# EAGLE design untitled (EAGLE 7.2.0)
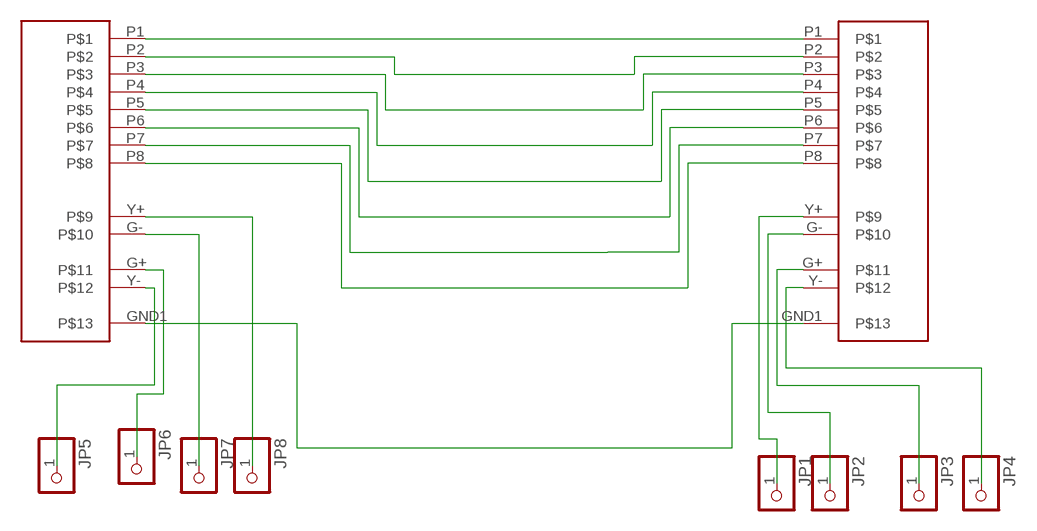
[diagram p0: schematic, sheet 1]

## Parts
JP1  PINHD-1X1  [1X01]
JP2  PINHD-1X1  [1X01]
JP3  PINHD-1X1  [1X01]
JP4  PINHD-1X1  [1X01]
JP5  PINHD-1X1  [1X01]
JP6  PINHD-1X1  [1X01]
JP7  PINHD-1X1  [1X01]
JP8  PINHD-1X1  [1X01]
U$14  RJ-45_LEDS  [RJ-45_LEDS]
U$15  RJ-45_LEDS  [RJ-45_LEDS]

## Nets
N$1: U$14.P1 U$15.P1
N$2: U$14.GND1 U$15.GND1
N$3: JP5.1 U$14.Y-
N$4: JP6.1 U$14.G+
N$5: JP7.1 U$14.G-
N$6: JP8.1 U$14.Y+
N$7: JP4.1 U$15.Y-
N$8: JP3.1 U$15.G+
N$9: JP2.1 U$15.G-
N$10: JP1.1 U$15.Y+
N$14: U$14.P2 U$15.P2
N$15: U$14.P3 U$15.P3
N$16: U$14.P4 U$15.P4
N$17: U$14.P5 U$15.P5
N$18: U$14.P6 U$15.P6
N$19: U$14.P7 U$15.P7
N$20: U$14.P8 U$15.P8

## Library data of the parts
JP1-JP8 = adafruit:PINHD-1X1: Pin header 1x1 for 0.1" spacing With round pins
U$14 U$15 = con-pc:RJ-45_LEDS: RJ-45 connector with 2 leds

## Board
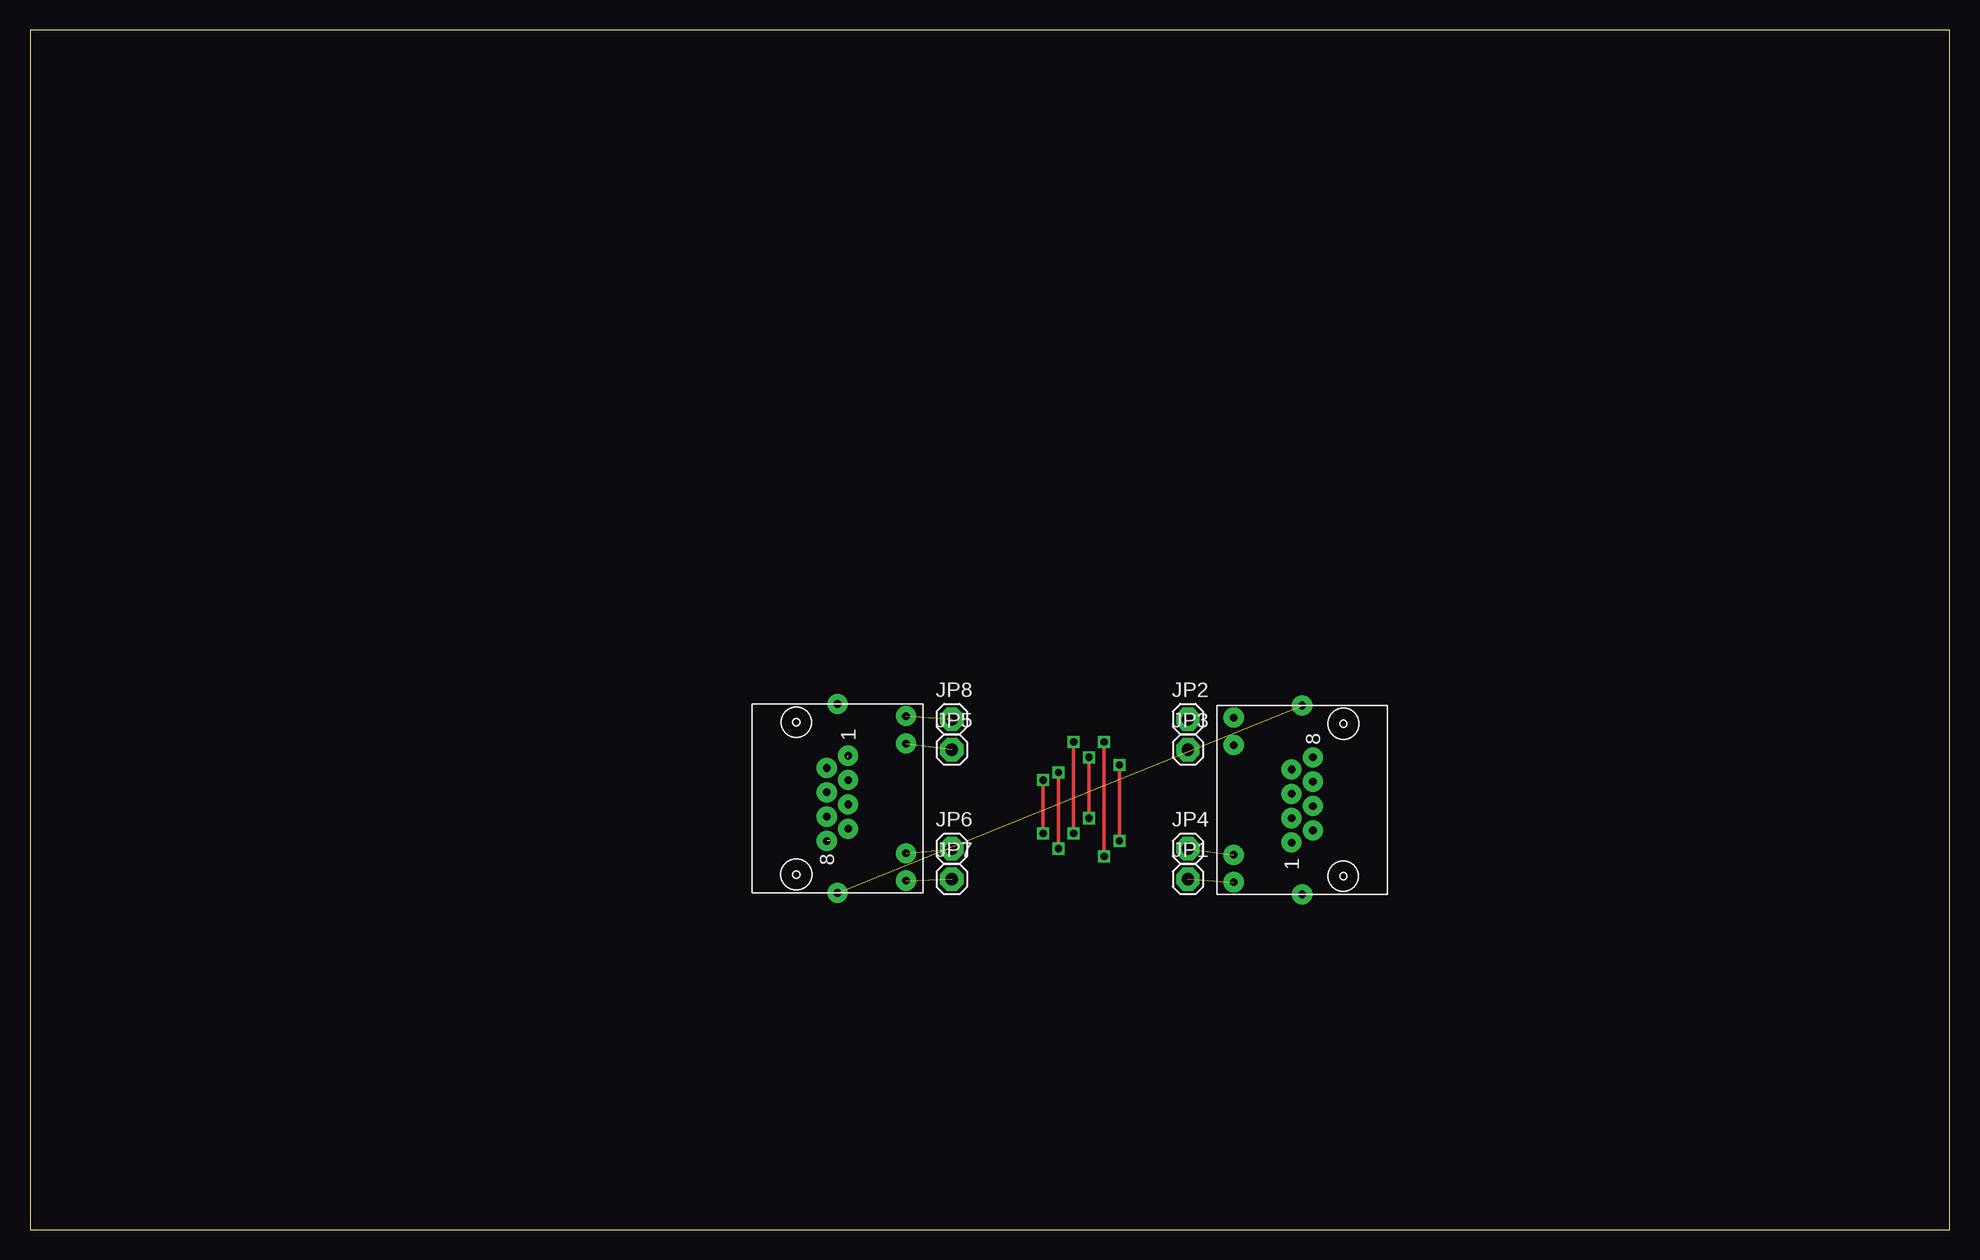
[diagram p1: board, top side]
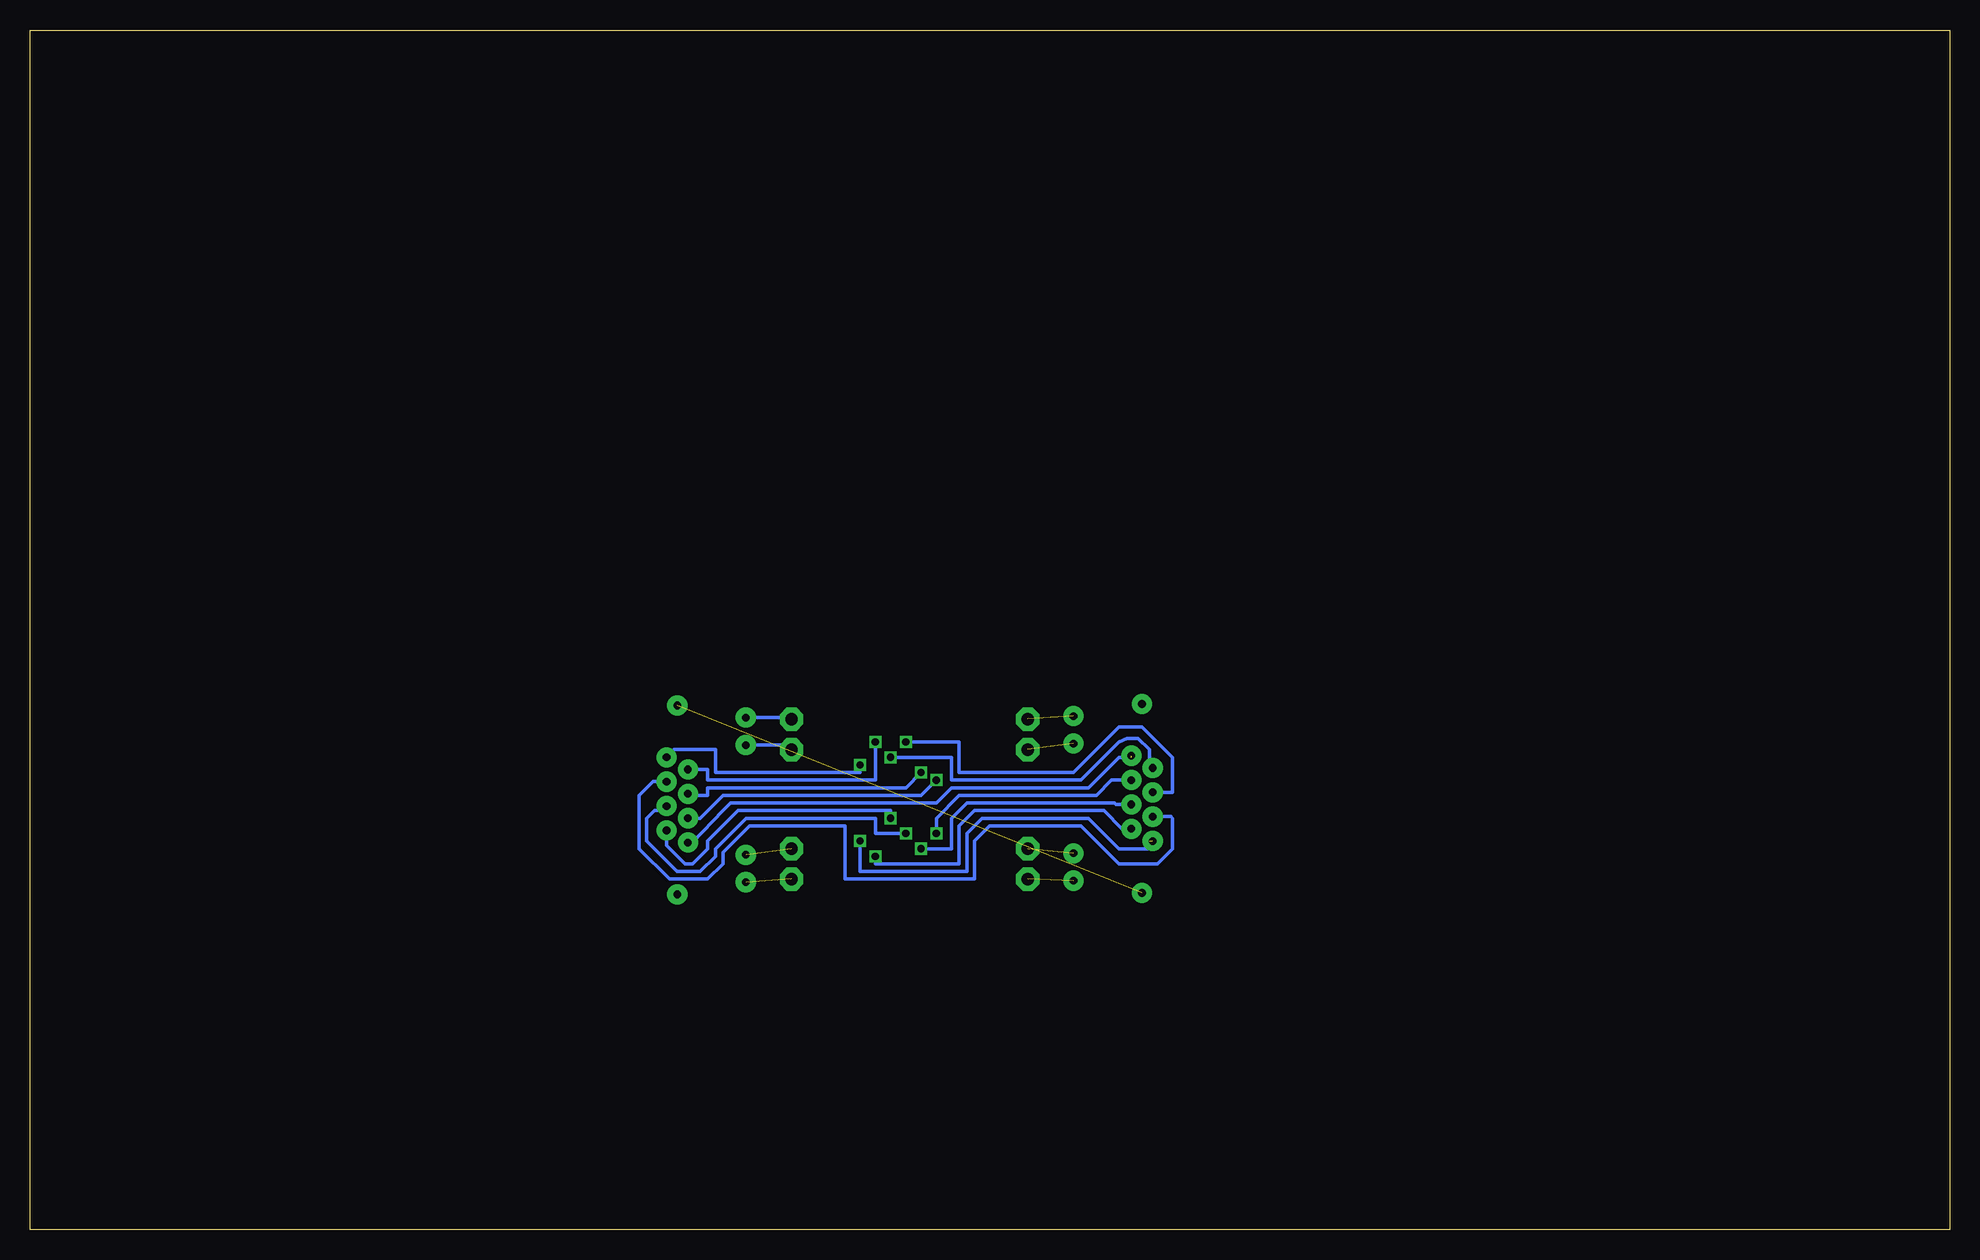
[diagram p2: board, bottom side, seen from below]

Size 160 x 100 mm. Coordinates in mm from the lower left corner, seen from the top.
Outline: 0,0 160,0 160,100 0,100 0,0
Copper layers (1*16): Top 0.035mm / dielectric 1.5mm / Bottom 0.035mm
Design rules "default *": minimum track width 10mil, minimum drill 24mil, track to track 8mil, track to pad 8mil, pad to pad 8mil, via to via 8mil, smd to smd 8mil, copper to edge 40mil, drill to drill 8mil, minimum pad ring 10mil, minimum via ring 8mil, stop-mask expansion 4mil, vias tented up to drill 0mil, thermal gap 10mil

### Footprints (pad centres in the part's own frame; a part is rotated, then mirrored left to right if it is on the bottom)
1X01 = drill 1.016 pad 1.93 octagon: 1 0,0
RJ-45_LEDS = drill 0.635 pad 1.676: G+ -9.525,4.826; G- -9.525,7.112; GND -3.81,-7.62; GND1 -3.81,8.128; P1 -4.699,-3.302; P2 -2.921,-2.286; P3 -4.699,-1.27; P4 -2.921,-0.254; P5 -4.699,0.762; P6 -2.921,1.778; P7 -4.699,2.794; P8 -2.921,3.81; Y+ -9.525,-6.604; Y- -9.525,-4.318

### Placement (x,y rotation side)
JP1  96.52,29.21 0 top
JP2  96.52,42.55 0 top
JP3  96.52,40.01 0 top
JP4  96.52,31.75 0 top
JP5  76.83,40.01 0 top
JP6  76.83,31.75 0 top
JP7  76.83,29.21 0 top
JP8  76.83,42.55 0 top
U$14  63.5,36.2 180 top
U$15  109.86,35.56 0 top

### Tracks (layer width: path | path; a pad name or v marks a point on that pad's centre or on a via)
N$1  (1 unrouted)
  Bottom 0.305: U$15.P1 104.78,32.26 102.23,34.92 101.6,35.56 84.45,35.56 83.19,36.83 71.75,36.83 69.22,39.37 68.2,39.37
N$2  (1 unrouted)
N$3  (1 unrouted)
N$4  (1 unrouted)
N$5  (1 unrouted)
N$6  (1 unrouted)
N$7  (1 unrouted)
N$8
  Bottom 0.305: JP3.1 96.9,40.39 U$15.G+
N$9
  Bottom 0.305: JP2.1 96.65,42.67 U$15.G-
N$10  (1 unrouted)
N$14  (via drill 0.6)
  Top 0.305: v88.27,39.37 v88.27,34.29
  Bottom 0.305: U$14.P2 66.67,38.73 66.67,40.01 67.63,40.96 68.58,40.96 69.22,40.64 72.39,37.47 83.19,37.47 83.19,39.37 v88.27,39.37 | v88.27,34.29 88.27,34.92 100.97,34.92 103.5,32.38 103.5,31.75 104.78,30.48 105.41,30.48 106.93,32 U$15.P2
N$15  (via drill 0.6)
  Top 0.305: v84.45,37.47 v84.45,33.02
  Bottom 0.305: U$15.P3 104.14,34.29 102.23,36.2 85.72,36.2 v84.45,37.47 | v84.45,33.02 84.45,34.29 82.55,36.2 71.12,36.2 69.85,37.47 U$14.P3
N$16  (via drill 0.6)
  Top 0.305: v87,40.64 v87,33.02
  Bottom 0.305: U$14.P4 64.77,36.45 64.77,39.37 67.31,41.91 69.22,41.91 73.03,38.1 82.55,38.1 82.55,40.64 v87,40.64 | U$15.P4 107.31,34.92 107.95,34.92 108.58,34.29 108.58,32.38 106.05,29.84 104.14,29.84 102.87,31.11 102.87,31.75 100.33,34.29 89.53,34.29 89.53,33.02 v87,33.02
N$17  (via drill 0.6)
  Top 0.305: v85.72,38.1 v85.72,31.75
  Bottom 0.305: U$15.P5 105.03,36.2 103.5,36.2 103.5,36.83 87,36.83 v85.72,38.1 | v85.72,31.75 83.19,31.75 83.19,34.29 81.92,35.56 69.6,35.56 69.47,35.43 U$14.P5
N$18
  Bottom 0.305: U$14.P6 64.9,34.42 64.77,34.29 64.77,31.75 66.04,30.48 69.22,30.48 72.39,33.66 80.01,33.66 81.28,32.38 81.28,29.21 92.08,29.21 92.08,33.66 100.01,33.66 102.23,31.43 102.23,30.48 103.5,29.21 106.68,29.21 109.22,31.75 109.22,36.2 108.08,37.34 U$15.P6
N$19  (via drill 0.6)
  Top 0.305: v89.53,40.64 v89.53,31.11
  Bottom 0.305: U$15.P7 103.5,38.35 103.5,37.47 89.53,37.47 v89.53,40.64 | v89.53,31.11 89.53,30.48 82.55,30.48 82.55,33.66 81.28,34.92 70.48,34.92 68.96,33.4 U$14.P7
N$20  (via drill 0.6)  (1 unrouted)
  Top 0.305: v90.81,32.38 v90.81,38.73
  Bottom 0.305: v90.81,32.38 90.81,29.84 81.92,29.84 81.92,33.02 80.64,34.29 71.75,34.29 69.22,31.75 66.67,31.75 66.67,32.38 | v90.81,38.73 90.81,38.1 102.87,38.1 102.87,40.01 106.3,40.01 U$15.P8